# EAGLE design arduinoModuleSVS (EAGLE 6.3)
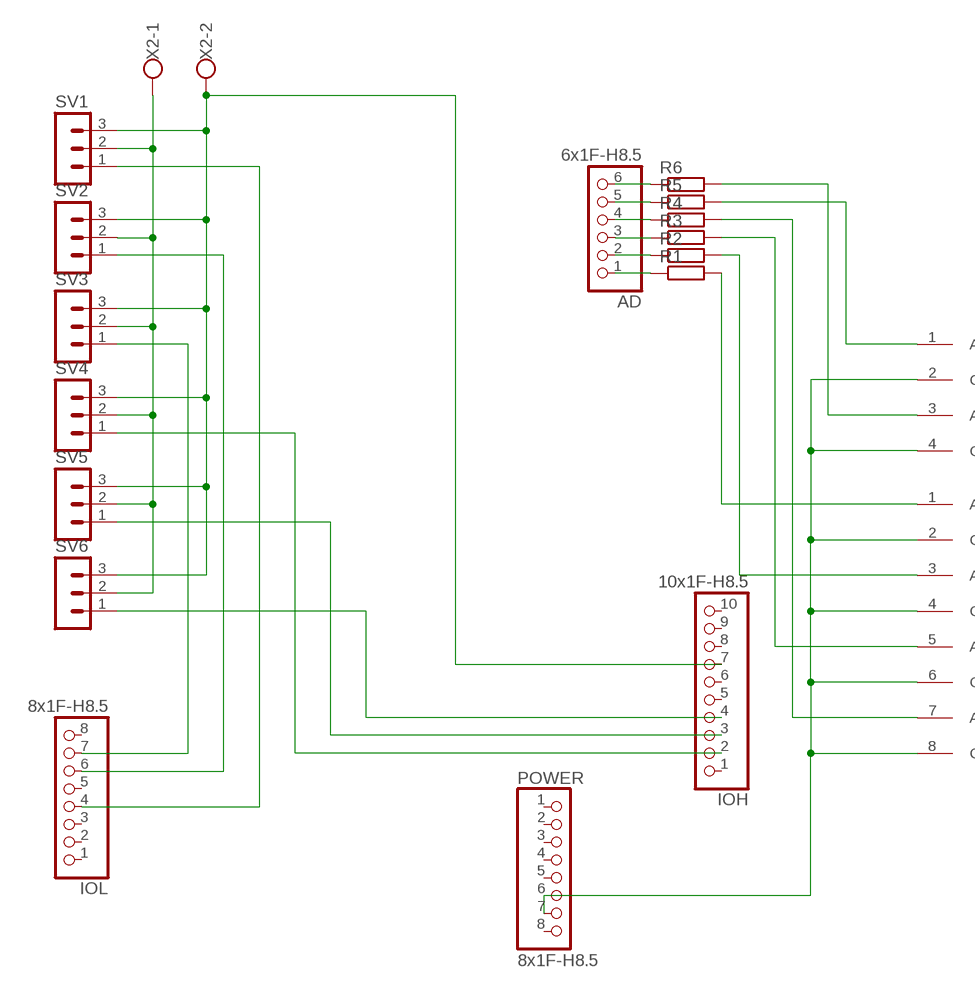
[diagram p0: schematic, sheet 1, part 1 of 2]
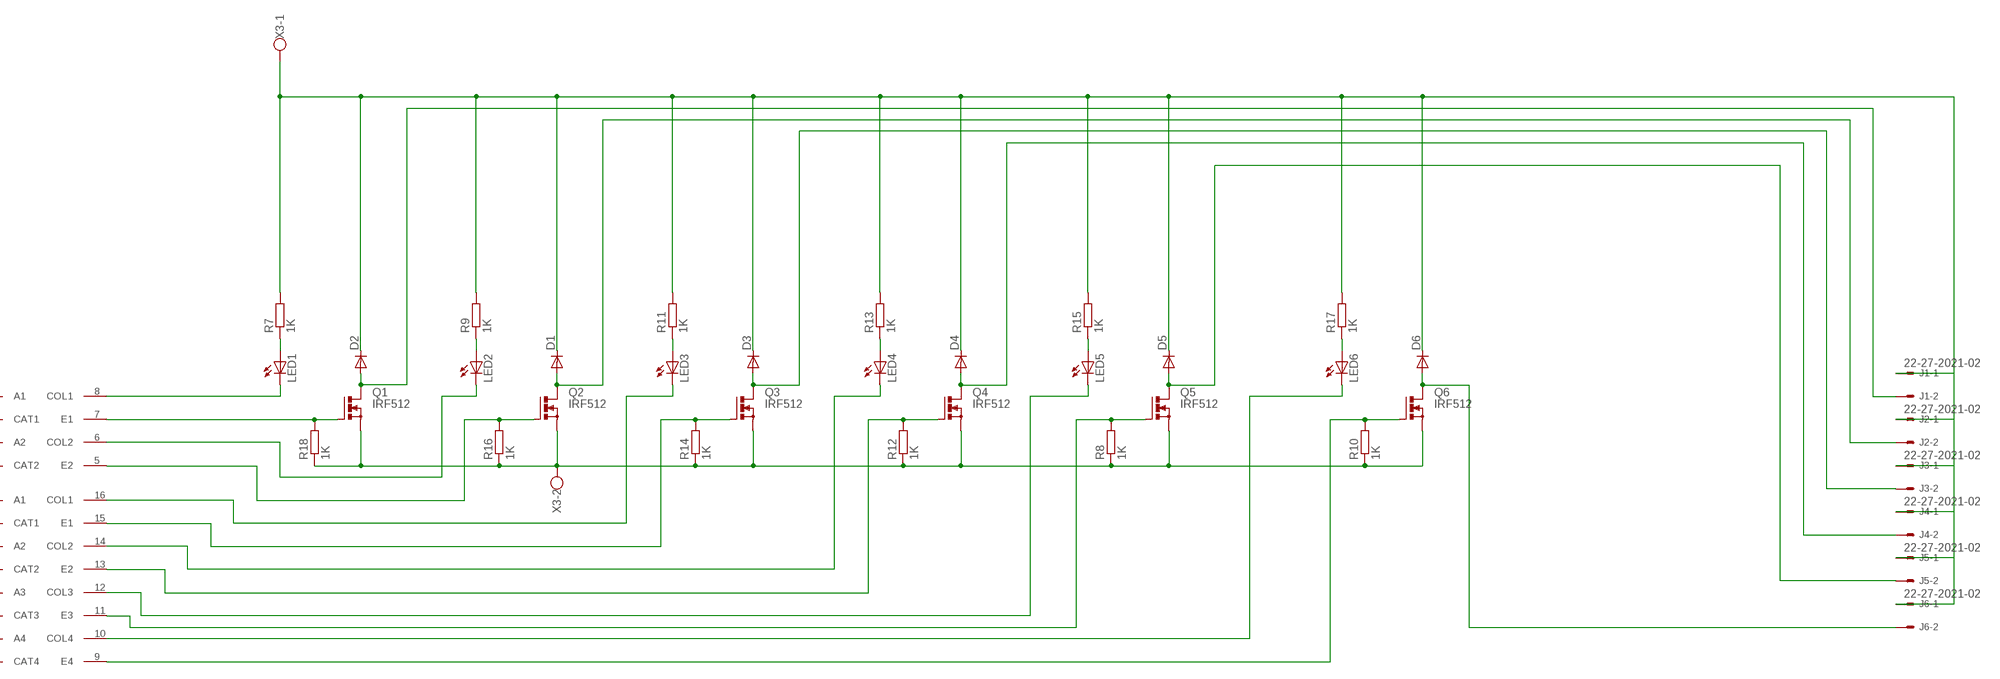
[diagram p1: schematic, sheet 1, part 2 of 2]

## Parts
AD  6x1F-H8.5  SMARTPRJ_PINHD-1X6  [SMARTPRJ_1X06]
D1  DIODE-SOD123  [SOD123]
D2  DIODE-SOD123  [SOD123]
D3  DIODE-SOD123  [SOD123]
D4  DIODE-SOD123  [SOD123]
D5  DIODE-SOD123  [SOD123]
D6  DIODE-SOD123  [SOD123]
IOH  10x1F-H8.5  SMARTPRJ_PINHD-1X10_ARD  [SMARTPRJ_1X10]
IOL  8x1F-H8.5  SMARTPRJ_PINHD-1X8  [SMARTPRJ_1X08]
J1  22-27-2021-02  [6410-02]
J2  22-27-2021-02  [6410-02]
J3  22-27-2021-02  [6410-02]
J4  22-27-2021-02  [6410-02]
J5  22-27-2021-02  [6410-02]
J6  22-27-2021-02  [6410-02]
LED1  LED3MM  [LED3MM]
LED2  LED3MM  [LED3MM]
LED3  LED3MM  [LED3MM]
LED4  LED3MM  [LED3MM]
LED5  LED3MM  [LED3MM]
LED6  LED3MM  [LED3MM]
POWER  8x1F-H8.5  SMARTPRJ_PINHD-1X8  [SMARTPRJ_1X08]
Q1  IRF512  [TO220BV]
Q2  IRF512  [TO220BV]
Q3  IRF512  [TO220BV]
Q4  IRF512  [TO220BV]
Q5  IRF512  [TO220BV]
Q6  IRF512  [TO220BV]
R1  R-EU_R0805  [R0805]
R2  R-EU_R0805  [R0805]
R3  R-EU_R0805  [R0805]
R4  R-EU_R0805  [R0805]
R5  R-EU_R0805  [R0805]
R6  R-EU_R0805  [R0805]
R7  1K  R-EU_R0805  [R0805]
R8  1K  R-EU_R0805  [R0805]
R9  1K  R-EU_R0805  [R0805]
R10  1K  R-EU_R0805  [R0805]
R11  1K  R-EU_R0805  [R0805]
R12  1K  R-EU_R0805  [R0805]
R13  1K  R-EU_R0805  [R0805]
R14  1K  R-EU_R0805  [R0805]
R15  1K  R-EU_R0805  [R0805]
R16  1K  R-EU_R0805  [R0805]
R17  1K  R-EU_R0805  [R0805]
R18  1K  R-EU_R0805  [R0805]
SV1  MA03-1  [MA03-1]
SV2  MA03-1  [MA03-1]
SV3  MA03-1  [MA03-1]
SV4  MA03-1  [MA03-1]
SV5  MA03-1  [MA03-1]
SV6  MA03-1  [MA03-1]
U$1  ACPL-847-W00E  [DIL16]
U$2  ACPL-827-00CE  [DIL08]
X2  W237-102  [W237-102]
X3  W237-102  [W237-102]

## Nets
GND: POWER.6 POWER.7 U$1.2(CAT1) U$1.4(CAT2) U$1.6(CAT3) U$1.8(CAT4) U$2.2(CAT1) U$2.4(CAT2)
GND24V: Q1.S Q2.S Q3.S Q4.S Q5.S Q6.S R8.1 R10.1 R12.1 R14.1 R16.1 R18.1 X3.2
GNDARDUINO: IOH.7 SV1.3 SV2.3 SV3.3 SV4.3 SV5.3 SV6.3 X2.2
N$1: IOL.4 SV1.1
N$2: IOL.6 SV2.1
N$3: IOL.7 SV3.1
N$4: IOH.2 SV4.1
N$5: IOH.3 SV5.1
N$6: IOH.4 SV6.1
N$7: R1.2 U$1.1(A1)
N$8: R2.2 U$1.3(A2)
N$9: R3.2 U$1.5(A3)
N$10: AD.1 R1.1
N$11: R4.2 U$1.7(A4)
N$12: AD.2 R2.1
N$13: AD.3 R3.1
N$14: AD.4 R4.1
N$15: R6.2 U$2.3(A2)
N$16: R5.2 U$2.1(A1)
N$17: AD.6 R6.1
N$18: AD.5 R5.1
N$19: Q1.G R18.2 U$2.7(E1)
N$20: D2.A J1.2 Q1.D
N$21: LED2.K(C) U$2.6(COL2)
N$22: LED2.A R9.1
N$23: Q2.G R16.2 U$2.5(E2)
N$24: LED1.K(C) U$2.8(COL1)
N$25: D1.A J2.2 Q2.D
N$26: LED1.A R7.1
N$27: LED3.K(C) U$1.16(COL1)
N$28: LED3.A R11.1
N$29: Q3.G R14.2 U$1.15(E1)
N$30: D3.A J3.2 Q3.D
N$31: LED4.K(C) U$1.14(COL2)
N$32: LED4.A R13.1
N$33: Q4.G R12.2 U$1.13(E2)
N$34: D4.A J4.2 Q4.D
N$35: LED5.K(C) U$1.12(COL3)
N$36: LED5.A R15.1
N$37: Q5.G R8.2 U$1.11(E3)
N$38: D5.A J5.2 Q5.D
N$39: LED6.K(C) U$1.10(COL4)
N$40: LED6.A R17.1
N$41: Q6.G R10.2 U$1.9(E4)
N$42: D6.A J6.2 Q6.D
VCC6V: SV1.2 SV2.2 SV3.2 SV4.2 SV5.2 SV6.2 X2.1
VCC24: D1.C D2.C D3.C D4.C D5.C D6.C J1.1 J2.1 J3.1 J4.1 J5.1 J6.1 R7.2 R9.2 R11.2 R13.2 R15.2 R17.2 X3.1
Unconnected: IOH.1 IOH.5 IOH.6 IOH.8 IOH.9 IOH.10 IOL.1 IOL.2 IOL.3 IOL.5 IOL.8 POWER.1 POWER.2 POWER.3 POWER.4 POWER.5 POWER.8

## Library data of the parts
AD = arduinoModuleSVS:SMARTPRJ_PINHD-1X6: PIN HEADER
D1-D6 = diode:DIODE-: DIODE
IOH = arduinoModuleSVS:SMARTPRJ_PINHD-1X10_ARD: PIN HEADER
IOL POWER = arduinoModuleSVS:SMARTPRJ_PINHD-1X8: PIN HEADER
J1-J6 = con-molex:22-?-02: CONNECTOR wire to board 2.54 mm (.1 inch) pitch header; OC_FARNELL: unknown; OC_NEWARK: unknown
LED1-LED6 = led:LED: LED OSRAM: - CHIPLED LG R971, LG N971, LY N971, LG Q971, LY Q971, LO R971, LY R971 LH N974, LH R974 LS Q976, LO Q976, LY Q976 LO Q996 - Hyper CHIPLED LW Q18S LB Q993, LB Q99A, LB R99A - SideLED LS A670, LO A670, LY A670, LG A670, LP A670 LB A673, LV A673, LT A673, LW A673 LH A674 LY A675 LS A676, LA A676, LO A676, LY A676, LW A676 LS A679, LY A679, LG A679 - Hyper Micro SIDELED® LS Y876, LA Y876, LO Y876, LY Y876 LT Y87S - SmartLED LW L88C, LW L88S LB L89C, LB L89S, LG L890 LS L89K, LO L89K, LY L89K LS L896, LA L896, LO L896, LY L896 - TOPLED LS T670, LO T670, LY T670, LG T670, LP T670 LSG T670, LSP T670, LSY T670, LOP T670, LYG T670 LG T671, LOG T671, LSG T671 LB T673, LV T673, LT T673, LW T673 LH T674 LS T676, LA T676, LO T676, LY T676, LB T676, LH T676, LSB T676, LW T676 LB T67C, LV T67C, LT T67C, LS T67K, LO T67K, LY T67K, LW E67C LS E67B, LA E67B, LO E67B, LY E67B, LB E67C, LV E67C, LT E67C LW T67C LS T679, LY T679, LG T679 LS T770, LO T770, LY T770, LG T770, LP T770 LB T773, LV T773, LT T773, LW T773 LH T774 LS E675, LA E675, LY E675, LS T675 LS T776, LA T776, LO T776, LY T776, LB T776 LHGB T686 LT T68C, LB T68C - Hyper Mini TOPLED® LB M676 - Mini TOPLED Santana® LG M470 LS M47K, LO M47K, LY M47K Source: http://www.osram.convergy.de LUXEON: - LUMILED® LXK2-PW12-R00, LXK2-PW12-S00, LXK2-PW14-U00, LXK2-PW14-V00 LXK2-PM12-R00, LXK2-PM12-S00, LXK2-PM14-U00 LXK2-PE12-Q00, LXK2-PE12-R00, LXK2-PE12-S00, LXK2-PE14-T00, LXK2-PE14-U00 LXK2-PB12-K00, LXK2-PB12-L00, LXK2-PB12-M00, LXK2-PB14-N00, LXK2-PB14-P00, LXK2-PB14-Q00 LXK2-PR12-L00, LXK2-PR12-M00, LXK2-PR14-Q00, LXK2-PR14-R00 LXK2-PD12-Q00, LXK2-PD12-R00, LXK2-PD12-S00 LXK2-PH12-R00, LXK2-PH12-S00 LXK2-PL12-P00, LXK2-PL12-Q00, LXK2-PL12-R00 Source: www.luxeon.com KINGBRIGHT: KA-3528ASYC Source: www.kingbright.com
Q1-Q6 = transistor-power:IRF512: N-CHANNEL MOS FET
R1-R18 = resistor:R-EU_: RESISTOR, European symbol
SV1-SV6 = con-lstb:MA03-1: PIN HEADER; OC_FARNELL: unknown; OC_NEWARK: unknown
U$1 = wingX:ACPL-847-W00E
U$2 = wingX:ACPL-827-00CE
X2 X3 = con-wago-500:W237-102: WAGO SCREW CLAMP; MPN: 237-102; OC_FARNELL: unknown; OC_NEWARK: 70K9898

## Net classes
1 power: width 0.61 mm, drill 0.61 mm, clearance 0.254 mm
2 gnd: width 0.305 mm, drill 0.559 mm, clearance 0.254 mm
3 usbvcc: width 0.508 mm, drill 0.61 mm, clearance 0.254 mm
4 aref: width 0.406 mm, drill 0.61 mm, clearance 0.254 mm

## Board
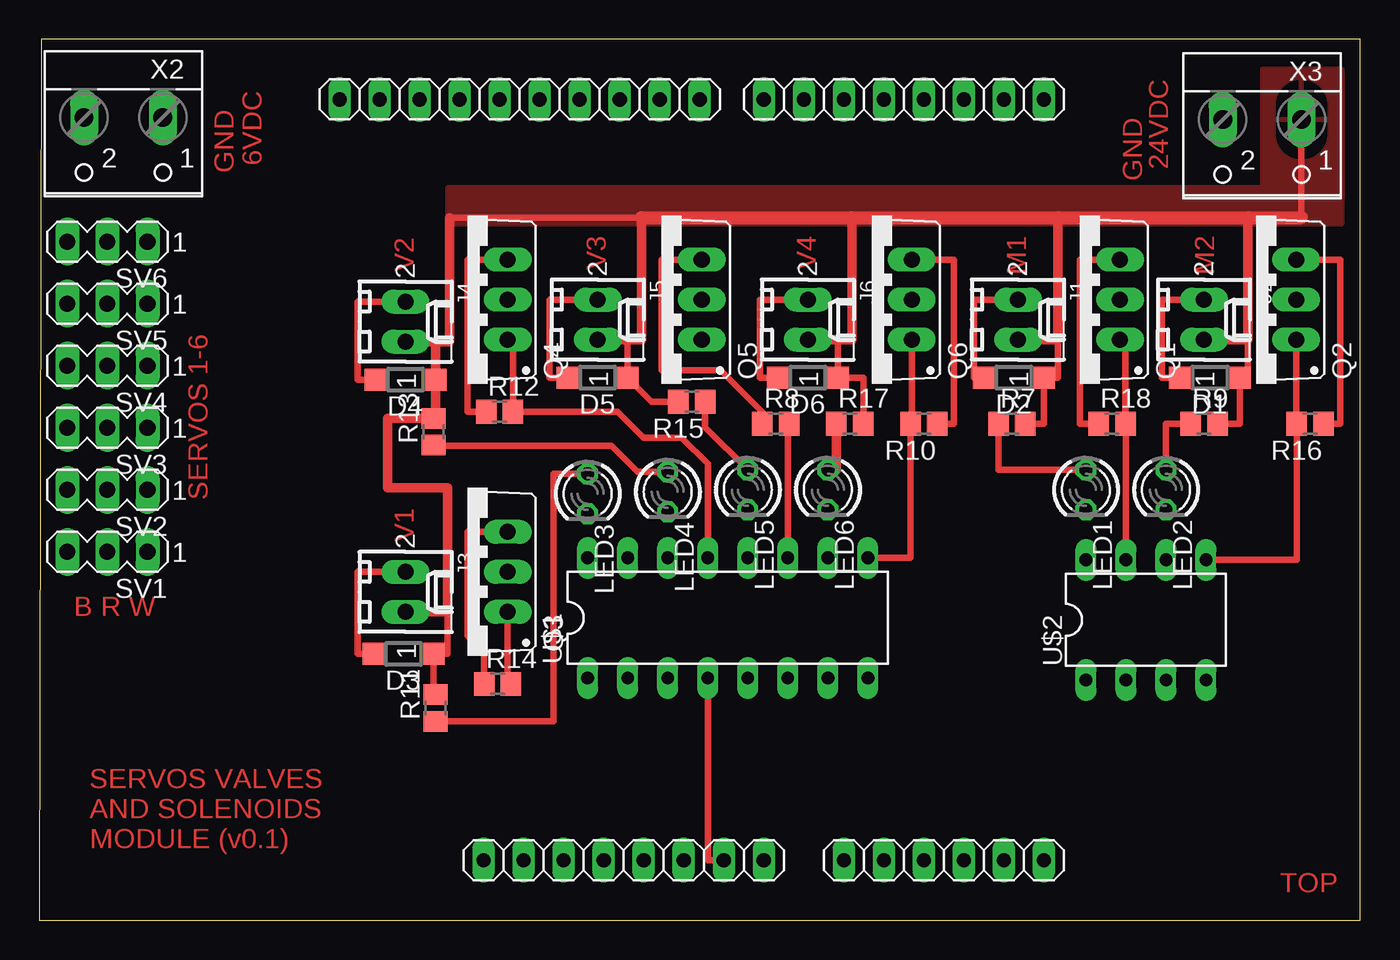
[diagram p2: board, top side]
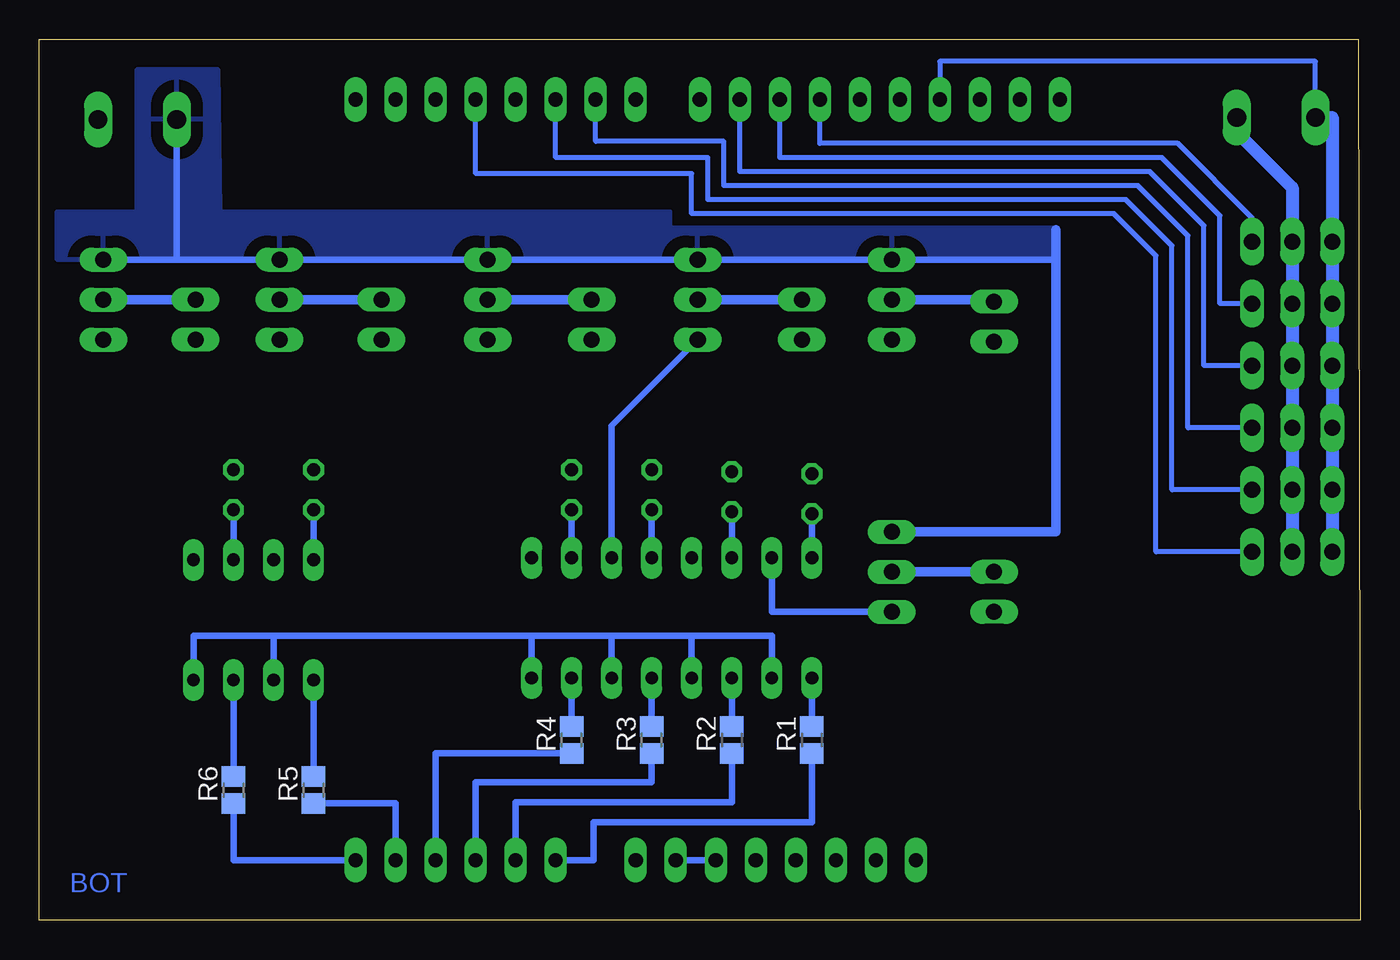
[diagram p3: board, bottom side, seen from below]

Size 83.82 x 55.88 mm. Coordinates in mm from the lower left corner, seen from the top.
Outline: 83.82,0 83.82,55.88 0.13,55.88 0,0 83.82,0
Copper layers (1*16): Top 0.035mm / dielectric 1.5mm / Bottom 0.035mm
Design rules "default *": minimum track width 10mil, minimum drill 22mil, track to track 0.5mm, track to pad 0.5mm, pad to pad 0.5mm, via to via 0.5mm, smd to smd 0.5mm, copper to edge 26mil, drill to drill 8mil, minimum pad ring 10mil, minimum via ring 10mil, stop-mask expansion 4mil, vias tented up to drill 0mil, thermal gap 30mil

### Footprints (pad centres in the part's own frame; a part is rotated, then mirrored left to right if it is on the bottom)
SMARTPRJ_1X06 = drill 0.9 pad 1.422 long: 1 -6.35,0; 2 -3.81,0; 3 -1.27,0; 4 1.27,0; 5 3.81,0; 6 6.35,0
SOD123 = smd 1.4 x 1.4: A 1.9,0; C -1.9,0
SMARTPRJ_1X10 = drill 0.9 pad 1.422 long: 1 -11.43,0; 2 -8.89,0; 3 -6.35,0; 4 -3.81,0; 5 -1.27,0; 6 1.27,0; 7 3.81,0; 8 6.35,0; 9 8.89,0; 10 11.43,0
SMARTPRJ_1X08 = drill 0.9 pad 1.422 long: 1 -8.89,0; 2 -6.35,0; 3 -3.81,0; 4 -1.27,0; 5 1.27,0; 6 3.81,0; 7 6.35,0; 8 8.89,0
6410-02 = drill 1.016 long: 1 1.27,0; 2 -1.27,0
LED3MM = drill 0.813 octagon: A -1.27,0; K 1.27,0
TO220BV = drill 1.016 long: D 0,-2.54; G -2.54,-2.54; S 2.54,-2.54
R0805 = smd 1.3 x 1.5: 1 -0.85,0; 2 0.85,0
MA03-1 = drill 1.016 long: 1 -2.54,0; 2 0,0; 3 2.54,0
DIL16 = drill 0.813 long: 1 -8.89,-3.81; 2 -6.35,-3.81; 3 -3.81,-3.81; 4 -1.27,-3.81; 5 1.27,-3.81; 6 3.81,-3.81; 7 6.35,-3.81; 8 8.89,-3.81; 9 8.89,3.81; 10 6.35,3.81; 11 3.81,3.81; 12 1.27,3.81; 13 -1.27,3.81; 14 -3.81,3.81; 15 -6.35,3.81; 16 -8.89,3.81
DIL08 = drill 0.813 long: 1 -3.81,-3.81; 2 -1.27,-3.81; 3 1.27,-3.81; 4 3.81,-3.81; 5 3.81,3.81; 6 1.27,3.81; 7 -1.27,3.81; 8 -3.81,3.81
W237-102 = drill 1.194 long: 1 -2.5,-1.27; 2 2.5,-1.27

### Placement (x,y rotation side)
AD  57.4,3.81 0 top
D1  74.3,34.42 180 top
D2  61.85,34.42 180 top
D3  23.11,16.89 180 top
D4  23.24,34.29 180 top
D5  35.43,34.42 180 top
D6  48.77,34.42 180 top
IOH  30.48,52.07 180 top
IOL  54.86,52.07 180 top
J1  62.1,38.1 270 top
J2  73.91,38.1 270 top
J3  23.24,20.83 270 top
J4  23.24,37.97 270 top
J5  35.43,38.1 270 top
J6  48.77,38.1 270 top
LED1  66.42,27.3 270 top
LED2  71.5,27.3 270 top
LED3  34.8,27.05 270 top
LED4  39.88,27.18 270 top
LED5  44.96,27.3 270 top
LED6  50.04,27.3 270 top
POWER  37.08,3.81 0 top
Q1  66.04,39.37 90 top
Q2  77.22,39.37 90 top
Q3  27.18,22.1 90 top
Q4  27.18,39.37 90 top
Q5  39.5,39.37 90 top
Q6  52.83,39.37 90 top
R1  34.8,11.43 90 bottom
R2  39.88,11.43 90 bottom
R3  44.96,11.43 90 bottom
R4  50.04,11.43 90 bottom
R5  66.42,8.26 90 bottom
R6  71.5,8.26 90 bottom
R7  61.72,31.5 0 top
R8  46.74,31.5 0 top
R9  73.91,31.5 0 top
R10  56.13,31.5 180 top
R11  25.15,13.46 90 top
R12  29.21,32.26 0 top
R13  25.02,30.99 90 top
R14  29.08,14.99 0 top
R15  41.4,32.89 180 top
R16  80.65,31.5 180 top
R17  51.43,31.5 0 top
R18  68.07,31.5 0 top
SV1  4.32,23.37 180 top
SV2  4.32,27.3 180 top
SV3  4.32,31.24 180 top
SV4  4.32,35.18 180 top
SV5  4.32,39.12 180 top
SV6  4.32,43.05 180 top
U$1  43.69,19.18 0 top
U$2  70.23,19.05 0 top
X2  5.33,49.66 180 top
X3  77.6,49.53 180 top

### Tracks (layer width: path | path; a pad name or v marks a point on that pad's centre or on a via)
GND
  Top 0.406: POWER.7 42.42,3.81 U$1.4
  Bottom 0.406: POWER.6 POWER.7 | U$2.4 74.04,18.03 68.96,18.03 | 68.96,18.03 U$2.2 | U$1.2 37.34,18.03 42.42,18.03 | 47.5,18.03 42.8,18.03 42.42,18.03 | 47.5,18.03 52.58,18.03 | 52.58,18.03 68.96,18.03 | U$1.8 52.58,18.03 | U$1.6 47.5,18.03 | U$1.4 42.42,18.03
GND24V
  Top 0.406: Q2.S 82.55,41.91 82.55,31.5 R16.1 | Q1.S 66.04,41.91 66.04,31.5 R18.1 | Q5.S 39.5,41.91 39.5,34.89 43.22,34.89 45.89,32.22 R8.1 | Q4.S 27.18,41.91 27.18,32.26 R12.1 | R14.1 28.23,16.98 27.18,18.03 27.18,24.64 Q3.S | R10.1 58.04,31.5 58.04,41.91 Q6.S
  Bottom 0.406: 75.1,41.91 Q1.S Q6.S Q5.S Q4.S 19.3,41.91 | 75.1,41.91 Q2.S | X3.2 75.1,41.91
  Bottom 0.61: Q3.S 19.3,24.64 19.3,41.91 19.3,43.82
  pour Bottom: 19.3,41.91 82.68,41.91 82.68,44.96 77.6,44.96 77.6,53.98 72.52,53.98 72.39,44.96 43.81,44.96 43.81,43.94 19.3,43.94
GNDARDUINO
  Bottom 0.305: X2.2 2.83,54.48 26.67,54.48 IOH.7
  Bottom 0.813: X2.2 1.78,50.93 SV6.3 SV5.3 SV4.3 SV3.3 SV2.3 SV1.3
N$1
  Bottom 0.305: SV1.1 12.95,23.37 12.95,42.16 15.62,44.83 42.42,44.83 42.42,47.37 56.13,47.37 IOL.4
N$2
  Bottom 0.305: SV2.1 11.94,27.3 11.94,42.8 14.86,45.72 41.4,45.72 41.4,48.39 51.05,48.39 IOL.6
N$3
  Bottom 0.305: SV3.1 10.92,31.24 10.92,43.43 14.1,46.61 40.39,46.61 40.39,49.4 48.51,49.4 IOL.7
N$4
  Bottom 0.305: SV4.1 9.91,35.18 9.91,44.07 13.33,47.5 39.37,47.5 IOH.2
N$5
  Bottom 0.305: SV5.1 8.89,39.12 8.89,44.7 12.57,48.39 36.83,48.39 IOH.3
N$6
  Bottom 0.305: SV6.1 6.86,44.58 11.56,49.28 34.29,49.28 IOH.4
N$7
  Bottom 0.406: R1.2 U$1.1
N$8
  Bottom 0.406: R2.2 U$1.3
N$9
  Bottom 0.406: R3.2 U$1.5
N$10
  Bottom 0.406: AD.1 48.64,3.81 48.64,6.22 34.8,6.22 R1.1
N$11
  Bottom 0.406: R4.2 U$1.7
N$12
  Bottom 0.406: AD.2 53.59,7.49 39.88,7.49 R2.1
N$13
  Bottom 0.406: AD.3 56.13,8.76 44.96,8.76 R3.1
N$14
  Bottom 0.406: AD.4 58.67,10.58 R4.1
N$15
  Bottom 0.406: R6.2 U$2.3
N$16
  Bottom 0.406: R5.2 U$2.1
N$17
  Bottom 0.406: AD.6 71.5,3.81 R6.1
N$18
  Bottom 0.406: AD.5 61.21,7.4 R5.1
N$19
  Top 0.406: U$2.7 68.96,31.5 R18.2 68.92,36.83 Q1.G
N$20
  Top 0.406: D2.A 59.31,34.42 59.31,39.37 J1.2
  Bottom 0.61: J1.2 Q1.D
N$21
  Bottom 0.406: LED2.K U$2.6
N$22
  Top 0.406: R9.1 71.5,31.5 LED2.A
N$23
  Top 0.406: Q2.G 79.76,31.5 R16.2 79.8,22.86 U$2.5
N$24
  Bottom 0.406: LED1.K U$2.8
N$25
  Top 0.406: D1.A 71.25,34.42 71.25,39.37 J2.2
  Bottom 0.61: J2.2 Q2.D
N$26
  Top 0.406: R7.1 60.87,28.57 LED1.A
N$27
  Bottom 0.406: U$1.16 LED3.K
N$28
  Top 0.406: R11.1 32.64,12.61 32.64,28.32 LED3.A
N$29
  Top 0.406: R14.2 29.72,14.99 Q3.G
  Bottom 0.406: Q3.G 37.34,19.56 U$1.15
N$30
  Top 0.406: D3.A 20.19,16.89 20.19,22.1 J3.2
  Bottom 0.61: J3.2 Q3.D
N$31
  Bottom 0.406: U$1.14 LED4.K
N$32
  Top 0.406: R13.1 25.02,30.1 36.32,30.1 37.97,28.45 LED4.A
N$33
  Top 0.406: Q4.G 30.06,36.83 R12.2 36.7,32.26 38.35,30.61 40.77,30.61 42.42,28.96 U$1.13
N$34
  Top 0.406: D4.A 20.19,34.29 20.19,39.24 J4.2
  Bottom 0.406: J4.2 23.24,39.37
  Bottom 0.61: 23.24,39.37 Q4.D
N$35
  Bottom 0.406: U$1.12 LED5.K
N$36
  Top 0.406: R15.1 42.25,31.28 LED5.A
N$37
  Top 0.406: R8.2 47.5,31.41 U$1.11
  Bottom 0.406: Q5.G 47.5,31.37 U$1.11
N$38
  Top 0.406: D5.A 32.38,34.42 32.38,39.37 J5.2
  Bottom 0.61: Q5.D J5.2
N$39
  Bottom 0.406: U$1.10 LED6.K
N$40
  Top 0.61: R17.1 50.59,28.57 LED6.A
N$41
  Top 0.406: Q6.G 55.37,31.5 R10.2 55.28,22.99 U$1.9
N$42
  Top 0.406: D6.A 45.72,34.42 45.72,39.37 J6.2
  Bottom 0.61: J6.2 Q6.D
VCC6V
  Bottom 0.813: X2.1 7.83,50 4.32,46.48 SV6.2 SV5.2 SV4.2 SV3.2 SV2.2 SV1.2
VCC24
  Top 0.406: 80.1,44.58 X3.1 | 50.67,36.83 D6.C 52.28,34.42 R17.2 | J5.1 37.33,36.83 D5.C 38.86,32.89 R15.2 | 26.04,44.58 38.23,44.58 | 25.14,31.96 R13.2 | R11.2 25.01,14.31 D3.C 25.91,16.89 25.91,19.56 | R7.2 63.75,31.5 D2.C 64.64,34.42 64.64,36.83 | 76.71,36.83 76.71,34.93 arc-90 D1.C 76.2,31.5 R9.2
  Top 0.61: J2.1 76.71,36.83 76.71,44.58 | J1.1 64.64,36.83 64.64,44.58 | J6.1 50.67,36.83 51.56,36.83 51.56,44.58 | J5.1 38.23,36.83 38.23,44.58 | 25.14,36.7 D4.C 25.14,31.96 | 25.14,36.7 J4.1 | 25.14,36.7 26.04,36.7 26.04,44.58 | J3.1 25.91,19.56 25.91,27.43 22.1,27.43 22.1,31.84 R13.2
  Top 0.813: 80.1,44.58 76.71,44.58 64.64,44.58 51.56,44.58 38.23,44.58
  pour Top: 77.6,53.98 77.6,46.48 25.91,46.48 25.91,44.2 82.68,44.2 82.68,53.98

### Text on the board
Top: 24VDC | GND | GND | 6VDC | V2 | V3 | V4 | M1 | M2 | SERVOS 1-6 | V1 | B R W | SERVOS VALVES / AND SOLENOIDS / MODULE (v0.1) | TOP
Bottom: BOT
214bmp: D:/SmartProjects/Snc/a4_bn_logo2.bmp